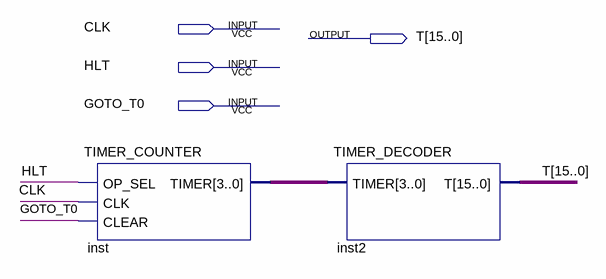
[diagram p0: schematic sheet]
// Quartus schematic CONTROL_UNIT_TIMER.bdf as structural Verilog: 2 symbols, 4 pins
module CONTROL_UNIT_TIMER (
  input  CLK,
  input  HLT,
  input  GOTO_T0,
  output [15:0] T
);

  wire [3:0] inst_timer;

  TIMER_COUNTER inst (.OP_SEL(HLT), .CLK(CLK), .CLEAR(GOTO_T0), .TIMER(inst_timer));
  TIMER_DECODER inst2 (.TIMER(inst_timer), .T(T));
endmodule
